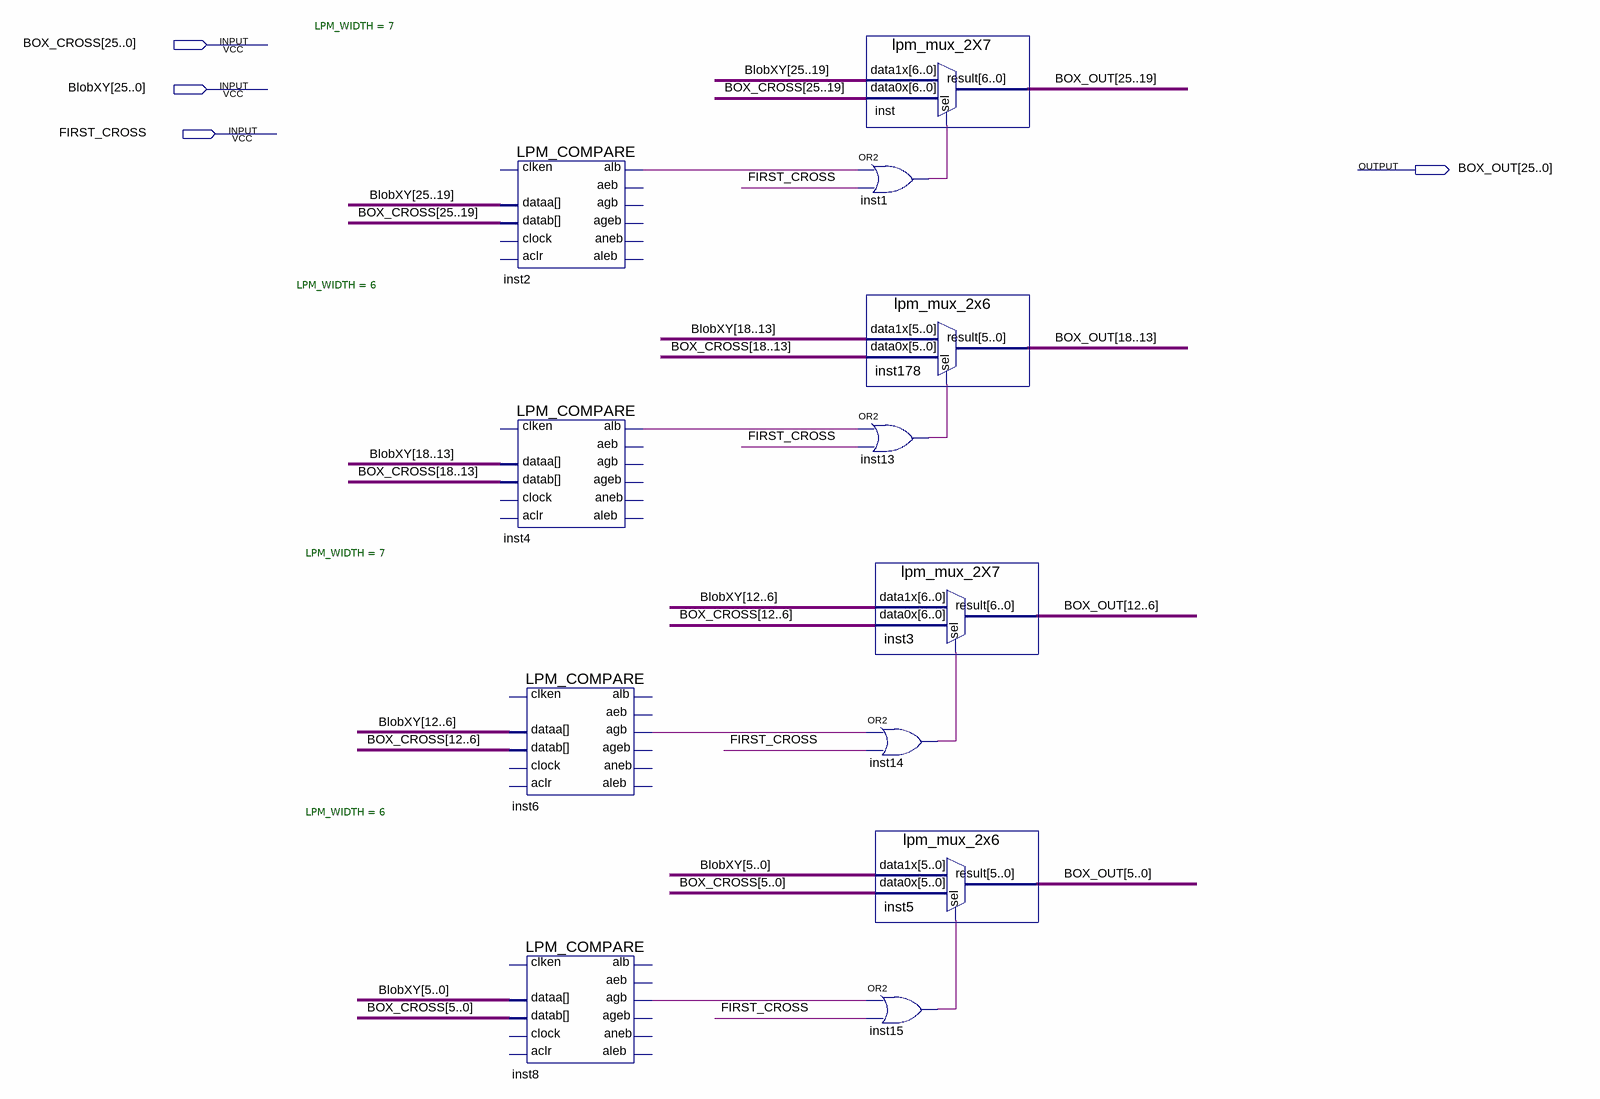
[diagram p0: schematic sheet]
// Quartus schematic HTPA_More_less.bdf as structural Verilog: 12 symbols, 4 pins
module HTPA_More_less (
  input  [25:0] BOX_CROSS,
  input  [25:0] BlobXY,
  input  FIRST_CROSS,
  output [25:0] BOX_OUT
);

  wire inst1_out, inst2_alb, inst4_alb, inst6_agb, inst8_agb, inst13_out, inst14_out, inst15_out;

  LPM_COMPARE #(.LPM_WIDTH(7)) inst2 (
    .dataa(BlobXY[25:19]), .datab(BOX_CROSS[25:19]), .alb(inst2_alb));  // open: clock, aclr, clken, aleb, aeb, agb, aneb, ageb
  LPM_COMPARE #(.LPM_WIDTH(6)) inst4 (
    .dataa(BlobXY[18:13]), .datab(BOX_CROSS[18:13]), .alb(inst4_alb));  // open: clock, aclr, clken, aleb, aeb, agb, aneb, ageb
  LPM_COMPARE #(.LPM_WIDTH(7)) inst6 (
    .dataa(BlobXY[12:6]), .datab(BOX_CROSS[12:6]), .agb(inst6_agb));  // open: clock, aclr, clken, aleb, aeb, aneb, ageb, alb
  LPM_COMPARE #(.LPM_WIDTH(6)) inst8 (
    .dataa(BlobXY[5:0]), .datab(BOX_CROSS[5:0]), .agb(inst8_agb));  // open: clock, aclr, clken, aleb, aeb, aneb, ageb, alb
  lpm_mux_2X7 inst (.data1x(BlobXY[25:19]), .data0x(BOX_CROSS[25:19]), .sel(inst1_out), .result(BOX_OUT[25:19]));
  or inst1 (inst1_out, inst2_alb, FIRST_CROSS);
  lpm_mux_2x6 inst178 (.data1x(BlobXY[18:13]), .data0x(BOX_CROSS[18:13]), .sel(inst13_out), .result(BOX_OUT[18:13]));
  or inst13 (inst13_out, inst4_alb, FIRST_CROSS);
  lpm_mux_2X7 inst3 (.data1x(BlobXY[12:6]), .data0x(BOX_CROSS[12:6]), .sel(inst14_out), .result(BOX_OUT[12:6]));
  or inst14 (inst14_out, inst6_agb, FIRST_CROSS);
  lpm_mux_2x6 inst5 (.data1x(BlobXY[5:0]), .data0x(BOX_CROSS[5:0]), .sel(inst15_out), .result(BOX_OUT[5:0]));
  or inst15 (inst15_out, inst8_agb, FIRST_CROSS);
endmodule
